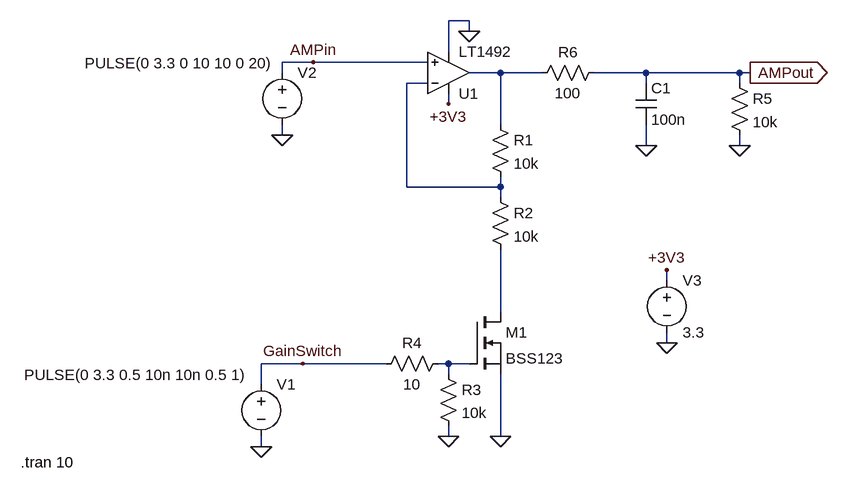
[diagram p0: schematic SwitchableGainAmplifier.asc]
SwitchableGainAmplifier.asc, the LTspice schematic file:
Version 4
SHEET 1 916 680
WIRE 112 -352 80 -352
WIRE 112 -336 112 -352
WIRE 80 -304 80 -352
WIRE -128 -288 -176 -288
WIRE 48 -288 -128 -288
WIRE -176 -272 -176 -288
WIRE 160 -272 112 -272
WIRE 224 -272 160 -272
WIRE 384 -272 304 -272
WIRE 528 -272 384 -272
WIRE 544 -272 528 -272
WIRE 48 -256 16 -256
WIRE 384 -256 384 -272
WIRE 528 -256 528 -272
WIRE 80 -224 80 -240
WIRE 160 -192 160 -272
WIRE -176 -176 -176 -192
WIRE 384 -160 384 -192
WIRE 528 -160 528 -176
WIRE 16 -96 16 -256
WIRE 160 -96 160 -112
WIRE 160 -96 16 -96
WIRE 160 -80 160 -96
WIRE 416 48 416 32
WIRE 160 96 160 0
WIRE 416 144 416 128
WIRE -144 176 -208 176
WIRE -16 176 -144 176
WIRE 80 176 64 176
WIRE 112 176 80 176
WIRE 80 192 80 176
WIRE -208 208 -208 176
WIRE 80 288 80 272
WIRE 160 288 160 192
WIRE -208 304 -208 288
FLAG 80 288 0
FLAG 160 288 0
FLAG -176 -176 0
FLAG -208 304 0
FLAG 416 144 0
FLAG 416 32 +3V3
FLAG 80 -224 +3V3
FLAG 112 -336 0
FLAG 528 -160 0
FLAG 544 -272 AMPout
IOPIN 544 -272 Out
FLAG -144 176 GainSwitch
FLAG -128 -288 AMPin
FLAG 384 -160 0
SYMBOL res 144 -96 R0
SYMATTR InstName R2
SYMATTR Value 10k
SYMBOL nmos 112 96 R0
SYMATTR InstName M1
SYMATTR Value BSS123
SYMBOL res 64 176 R0
SYMATTR InstName R3
SYMATTR Value 10k
SYMBOL res 80 160 R90
WINDOW 0 0 56 VBottom 2
WINDOW 3 32 56 VTop 2
SYMATTR InstName R4
SYMATTR Value 10
SYMBOL Opamps\\LT1492 80 -208 M180
SYMATTR InstName U1
SYMBOL voltage -208 192 R0
WINDOW 3 -365 1 Left 2
WINDOW 123 0 0 Left 0
WINDOW 39 0 0 Left 0
SYMATTR InstName V1
SYMATTR Value PULSE(0 3.3 0.5 10n 10n 0.5 1)
SYMBOL voltage -176 -288 R0
WINDOW 3 -304 1 Left 2
WINDOW 123 0 0 Left 0
WINDOW 39 0 0 Left 0
SYMATTR InstName V2
SYMATTR Value PULSE(0 3.3 0 10 10 0 20)
SYMBOL voltage 416 32 R0
WINDOW 123 0 0 Left 0
WINDOW 39 0 0 Left 0
SYMATTR InstName V3
SYMATTR Value 3.3
SYMBOL res 512 -272 R0
SYMATTR InstName R5
SYMATTR Value 10k
SYMBOL res 144 -208 R0
SYMATTR InstName R1
SYMATTR Value 10k
SYMBOL cap 368 -256 R0
SYMATTR InstName C1
SYMATTR Value 100n
SYMBOL res 320 -288 R90
WINDOW 0 0 56 VBottom 2
WINDOW 3 32 56 VTop 2
SYMATTR InstName R6
SYMATTR Value 100
TEXT -578 328 Left 2 !.tran 10

The netlist it stands for:
* SwitchableGainAmplifier.asc
R2 N002 N003 10k
M1 N003 N004 0 0 BSS123
R3 N004 0 10k
R4 N004 GainSwitch 10
XU1 AMPin N002 +3V3 0 N001 LT1492  ; pins In+ In- V+ V- OUT
V1 GainSwitch 0 PULSE(0 3.3 0.5 10n 10n 0.5 1)
V2 AMPin 0 PULSE(0 3.3 0 10 10 0 20)
V3 +3V3 0 3.3
R5 AMPout 0 10k
R1 N001 N002 10k
C1 AMPout 0 100n
R6 AMPout N001 100
.model NMOS NMOS
.model PMOS PMOS
.lib standard.mos
.tran 10
.backanno
.end